# EAGLE schematic SUB-UNIT (EAGLE 9.6.2)
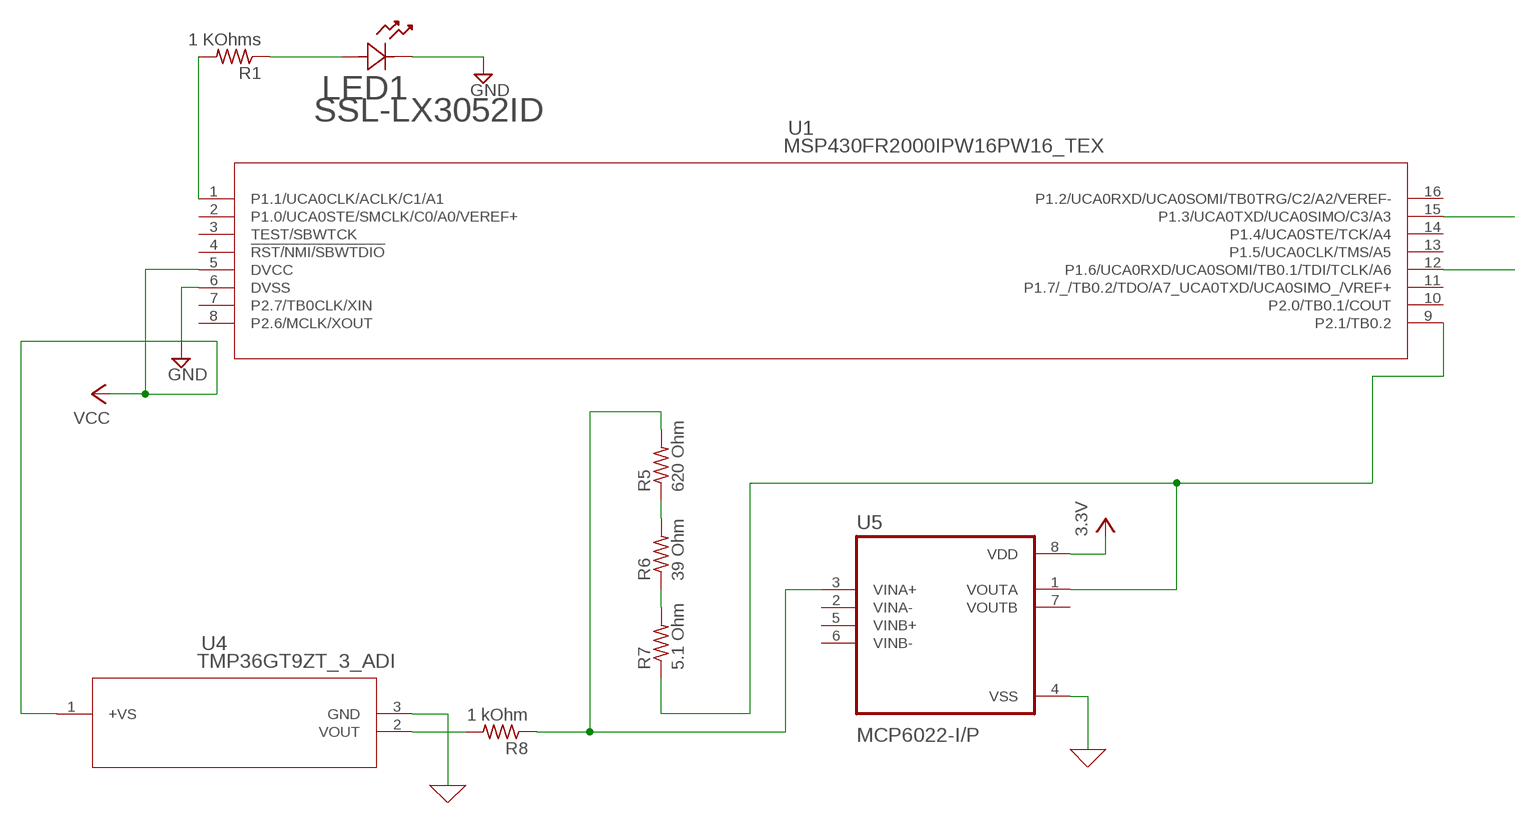
[diagram p0: schematic, sheet 1]

## Parts
LED1  SSL-LX3052ID  [LED_SSL-LX30_T-3_LUM]
R1  1 KOhms  R-US_0204/5  [0204/5]
R5  620 Ohm  R-US_0204/7  [0204/7]
R6  39 Ohm  R-US_0204/7  [0204/7]
R7  5.1 Ohm  R-US_0204/7  [0204/7]
R8  1 kOhm  R-US_0204/7  [0204/7]
U1  MSP430FR2000IPW16PW16_TEX  [PW16_TEX]
U4  TMP36GT9ZT_3_ADI  [T_3_ADI]
U5  MCP6022-I/P  [DIP787W46P254L927H533Q8]

## Nets
0: U4.3(GND) U5.4(VSS) ; supply symbol labelled GND
GND: LED1.1(ANODE) U1.6(DVSS)
N$1: LED1.2 R1.1
N$2: U1.12(P1.6/UCA0RXD/UCA0SOMI/TB0.1/TDI/TCLK/A6)
N$3: U1.15(P1.3/UCA0TXD/UCA0SIMO/C3/A3)
N$4: R1.2 U1.1(P1.1/UCA0CLK/ACLK/C1/A1)
N$5: R7.1 U1.9(P2.1/TB0.2) U5.1(VOUTA)
N$6: R8.2 U4.2(VOUT)
N$9: R6.1 R7.2
N$10: R5.1 R6.2
N$12: R5.2 R8.1 U5.3(VINA+)
VCC: U1.5(DVCC) U4.1(+VS) U5.8(VDD) ; supply symbol labelled 3.3V
Unconnected: U1.2(P1.0/UCA0STE/SMCLK/C0/A0/VEREF+) U1.3(TEST/SBWTCK) U1.4(!RST/NMI/SBWTDIO) U1.7(P2.7/TB0CLK/XIN) U1.8(P2.6/MCLK/XOUT) U1.10(P2.0/TB0.1/COUT) U1.11(P1.7/_/TB0.2/TDO/A7_UCA0TXD/UCA0SIMO_/VREF+) U1.13(P1.5/UCA0CLK/TMS/A5) U1.14(P1.4/UCA0STE/TCK/A4) U1.16(P1.2/UCA0RXD/UCA0SOMI/TB0TRG/C2/A2/VEREF-) U5.2(VINA-) U5.5(VINB+) U5.6(VINB-) U5.7(VOUTB)

## Library data of the parts
LED1 = Lumex SSL-LX3052ID RED LED:SSL-LX3052ID; COPYRIGHT: Copyright (C) 2023 Ultra Librarian. All rights reserved.; MANUFACTURER_PART_NUMBER: SSL-LX3052ID; MFR_NAME: Lumex
R1 = adafruit:R-US_: RESISTOR, American symbol
R5-R8 = rcl:R-US_: RESISTOR, American symbol; SPICEPREFIX: R
U1 = MSP430FR2000 Sub-Unit:MSP430FR2000IPW16; COPYRIGHT: Copyright (C) 2023 Ultra Librarian. All rights reserved.; MANUFACTURER_PART_NUMBER: MSP430FR2000IPW16; MFR_NAME: Texas Instruments
U4 = 2023-03-28_14-12-25_Library:TMP36GT9Z; COPYRIGHT: Copyright (C) 2023 Ultra Librarian. All rights reserved.; DIGI-KEY_PART_NUMBER_1: TMP36GT9Z-ND; DIGI-KEY_PART_NUMBER_2: 2156-TMP36GT9Z-ND; MANUFACTURER_PART_NUMBER: TMP36GT9Z; MFR_NAME: Analog Devices Inc
U5 = MCP6022-I_P:MCP6022-I/P